# EAGLE design air_quality_monitor (EAGLE 7.7.0)
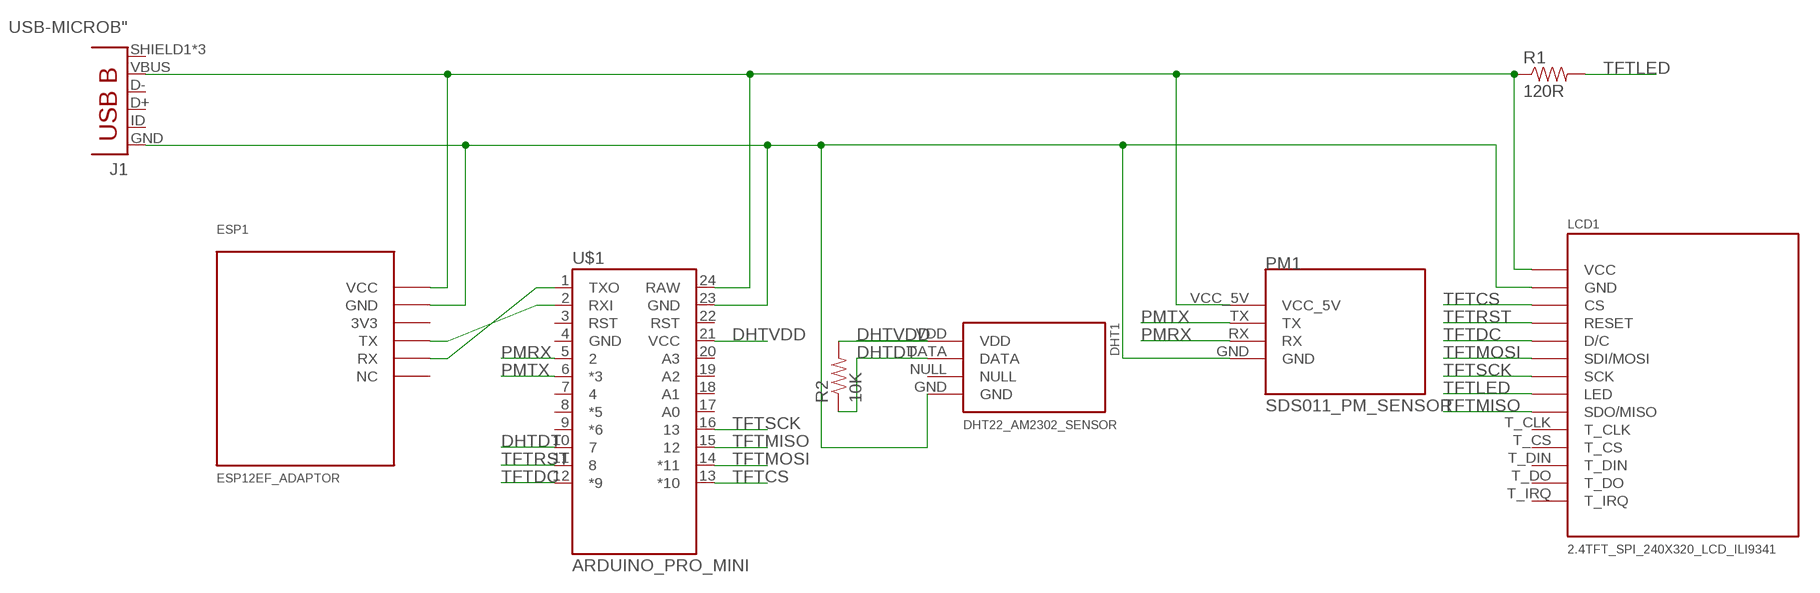
[diagram p0: schematic, sheet 1]

## Parts
DHT1  DHT22_AM2302_SENSOR  [DHT22_AM2302_SENSOR]
ESP1  ESP12EF_ADAPTOR  [ESP12EF_ADAPTOR]
J1  USB-MICROB"  [USB-B-MICRO-SMD_V03]
LCD1  2.4TFT_SPI_240X320_LCD_ILI9341  [2.4TFT_SPI_240X320_LCD_ILI9341]
PM1  SDS011_PM_SENSOR  [SDS011_PM_SENSOR]
R1  120R  10KOHM-1/10W-1%(0603)0603  [0603-RES]
R2  10K  10KOHM-1/10W-1%(0603)0603  [0603-RES]
U$1  ARDUINO_PRO_MINI  [ARDUINO_PRO_MINI]

## Nets
DHTDT: DHT1.DATA R2.1 U$1.10
DHTVDD: DHT1.VDD R2.2 U$1.21(VCC)
N$1: DHT1.GND ESP1.GND J1.GND LCD1.GND PM1.GND U$1.23(GND)
N$2: ESP1.VCC J1.VBUS LCD1.VCC PM1.VCC_5V R1.1 U$1.24(RAW)
N$8: ESP1.TX U$1.2(RXI)
N$9: ESP1.RX U$1.1(TXO)
PMRX: PM1.RX U$1.5
PMTX: PM1.TX U$1.6(*3)
TFTCS: LCD1.CS U$1.13(*10)
TFTDC: LCD1.D/C U$1.12(*9)
TFTLED: LCD1.LED R1.2
TFTMISO: LCD1.SDO/MISO U$1.15
TFTMOSI: LCD1.SDI/MOSI U$1.14(*11)
TFTRST: LCD1.RESET U$1.11
TFTSCK: LCD1.SCK U$1.16
Unconnected: DHT1.NULL ESP1.3V3 ESP1.NC J1.D+ J1.D- J1.ID(USBID) J1.SHIELD1(SHIELD) J1.SHIELD2(SHIELD) J1.SHIELD3(SHIELD) LCD1.T_CLK LCD1.T_CS LCD1.T_DIN LCD1.T_DO LCD1.T_IRQ U$1.3(RST) U$1.4(GND) U$1.7 U$1.8(*5) U$1.9(*6) U$1.17(A0) U$1.18(A1) U$1.19(A2) U$1.20(A3) U$1.22(RST)

## Library data of the parts
DHT1 = air_quality_monitor:DHT22_AM2302_SENSOR
ESP1 = air_quality_monitor:ESP12EF_ADAPTOR: ESP-12E/F Adaptor designed by IFFPC.
J1 = air_quality_monitor:USB-MICROB: RED_PASTE version has 70% paste area under D+ D- USBID pins for applications where those pins aren't required, to reduce the likelihood of bridges.; PROD_ID: CONN-11752
LCD1 = air_quality_monitor:2.4TFT_SPI_240X320_LCD_ILI9341: 2.2 inch 240x320 TFT LCD Module with SPI Interface.
PM1 = air_quality_monitor:SDS011_PM_SENSOR: SDS011 Laser PM2.5 Sensor Nova Fitness Co.,Ltd
R1 = air_quality_monitor:10KOHM-1/10W-1%(0603): RES-00824; PROD_ID: RES-00824; VALUE: 10K
R2 = air_quality_monitor:10KOHM-1/10W-1%(0603): RES-00824; PROD_ID: RES-00824
U$1 = air_quality_monitor:ARDUINO_PRO_MINI

## Board
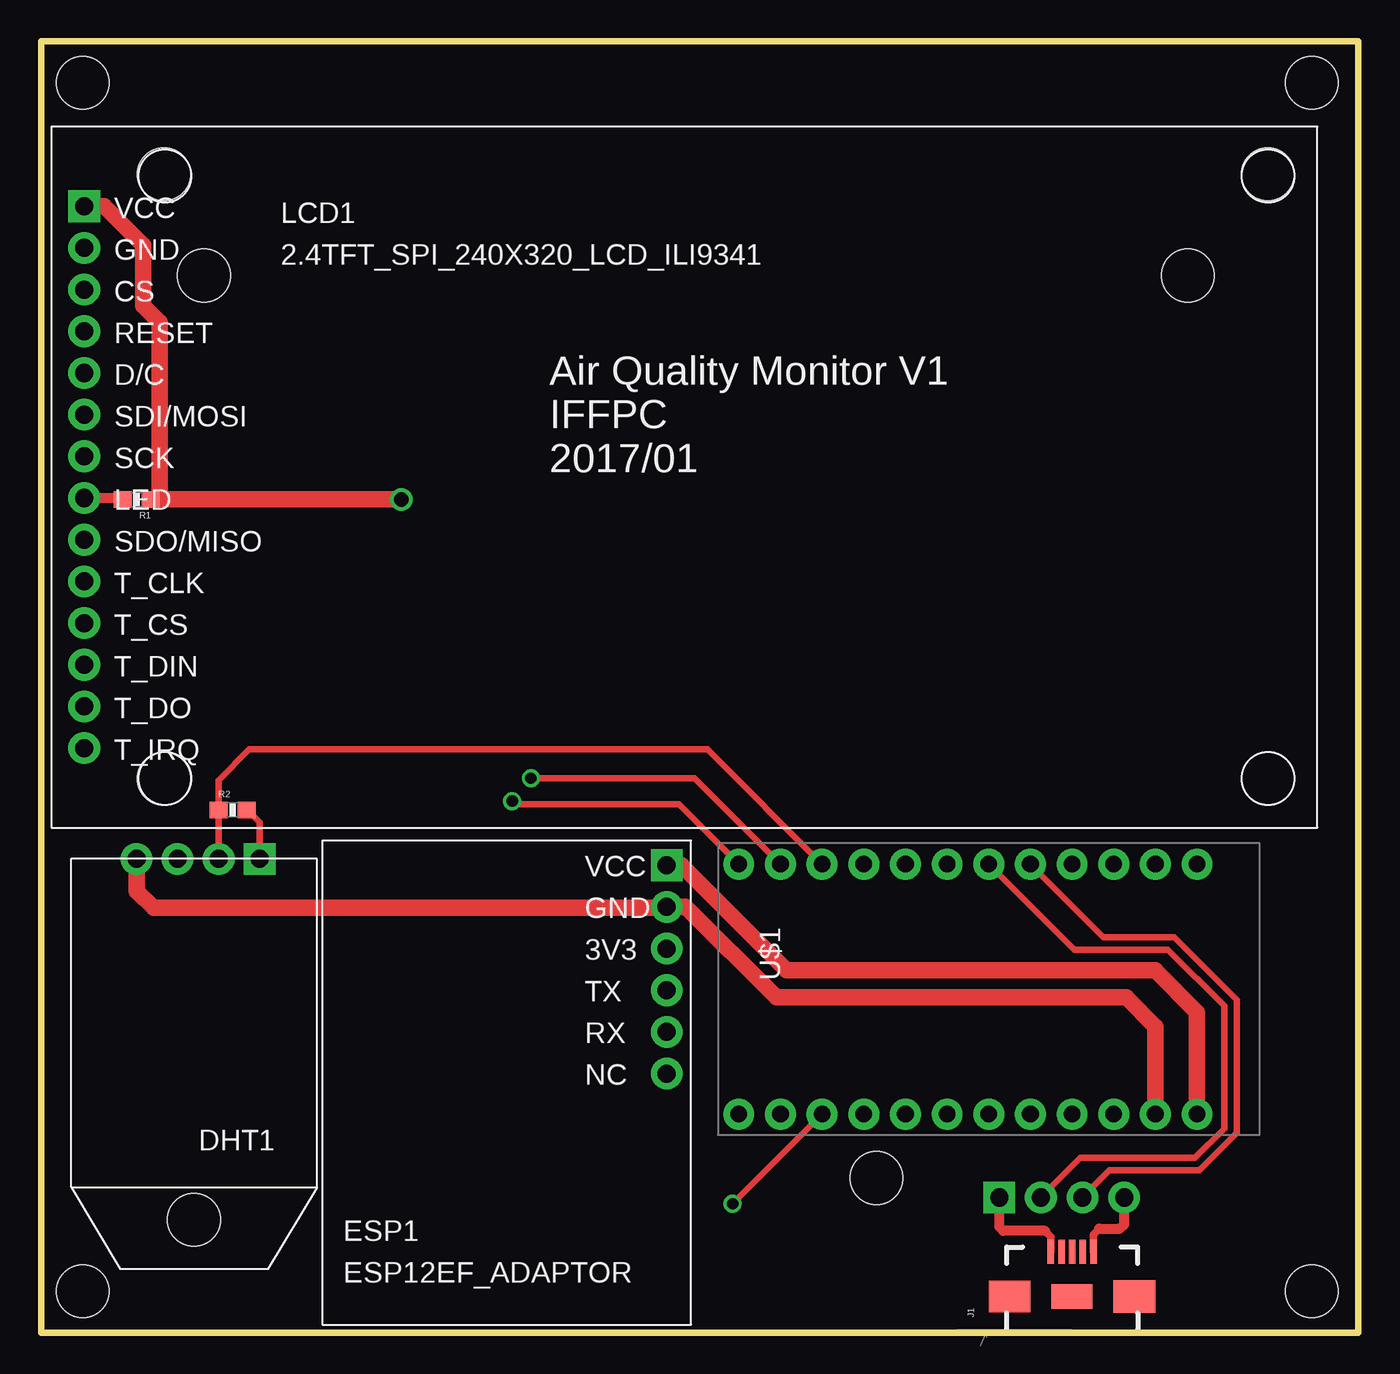
[diagram p1: board, top side]
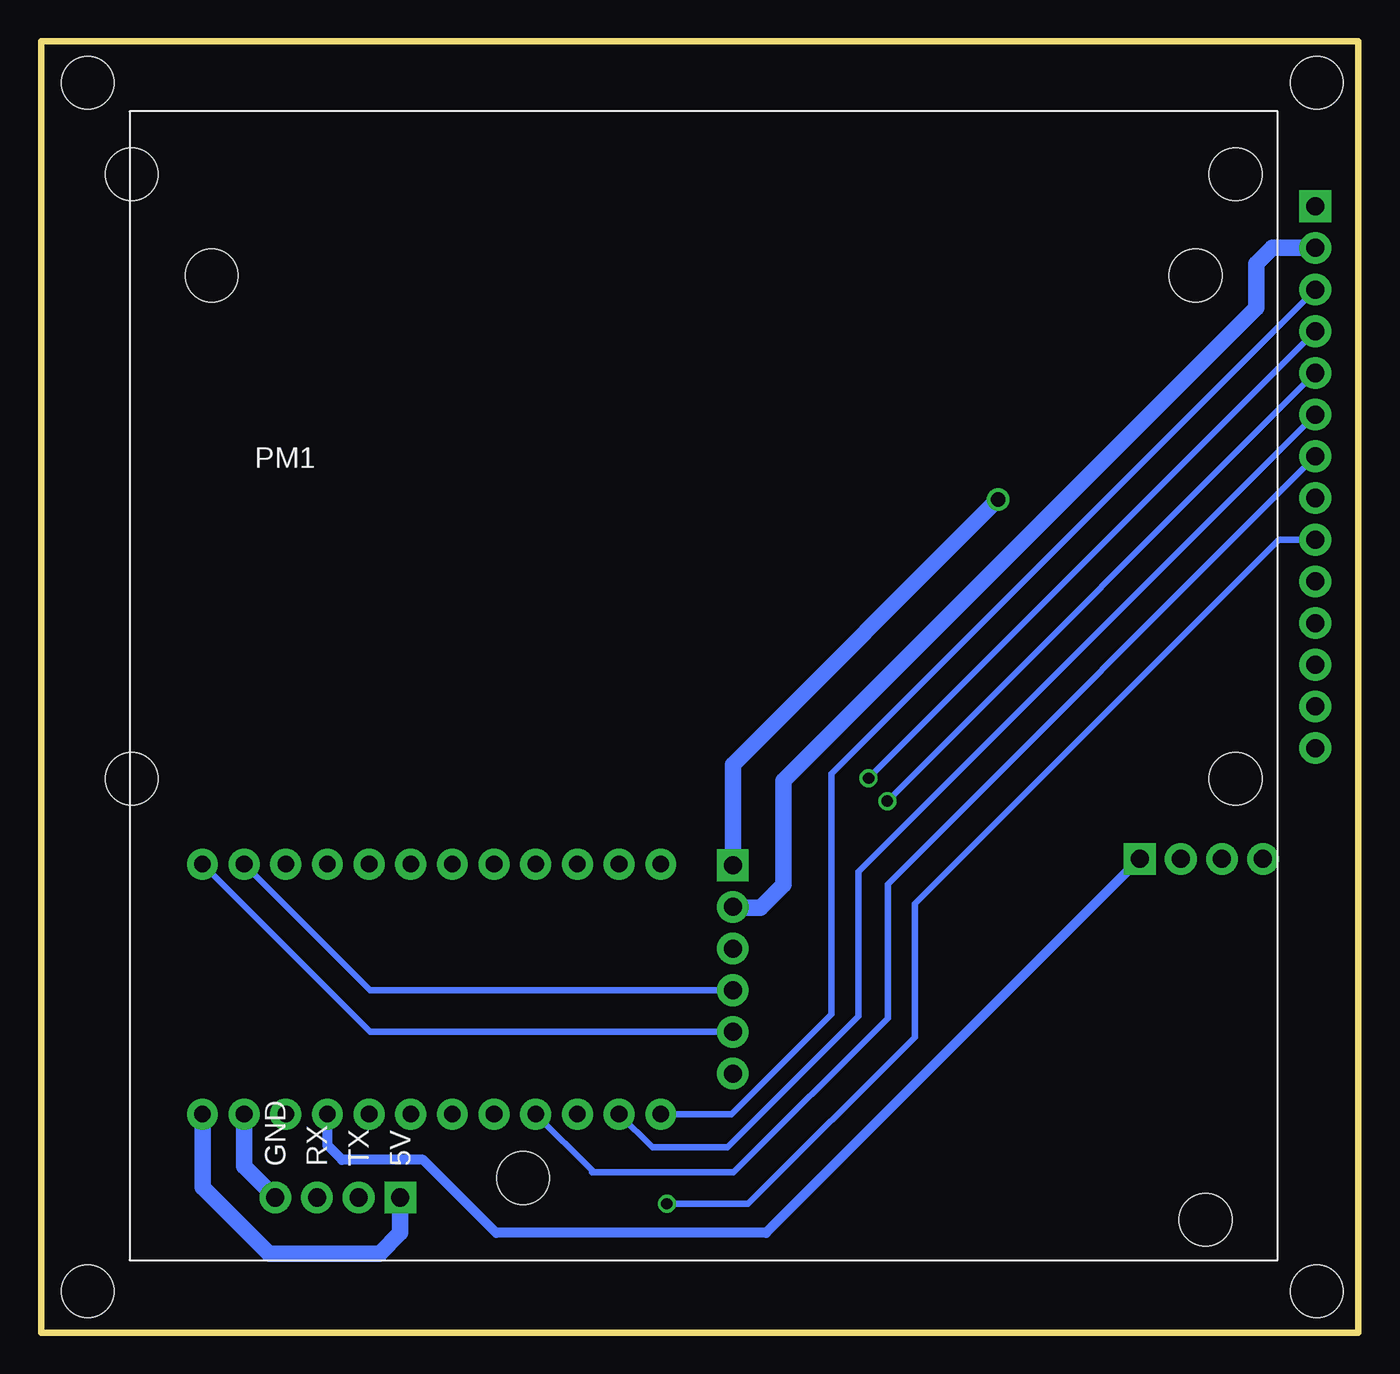
[diagram p2: board, bottom side, seen from below]

Size 80.33 x 78.74 mm. Coordinates in mm from the lower left corner, seen from the top.
Outline: 0,0 0,78.74 80.33,78.74 80.33,0 0,0
Copper layers (1*16): Top 0.035mm / dielectric 1.5mm / Bottom 0.035mm
Design rules "default": minimum track width 10mil, minimum drill 24mil, track to track 8mil, track to pad 8mil, pad to pad 8mil, via to via 8mil, smd to smd 8mil, copper to edge 40mil, drill to drill 8mil, minimum pad ring 10mil, minimum via ring 8mil, stop-mask expansion 4mil, vias tented up to drill 0mil, thermal gap 10mil
Holes 3.2 mm at 2.54,2.54 2.54,76.2 77.47,2.54 77.47,76.2 7.49,70.61 74.8,70.61 74.8,33.78 7.49,33.78

### Footprints (pad centres in the part's own frame; a part is rotated, then mirrored left to right if it is on the bottom)
DHT22_AM2302_SENSOR = drill 1.1 pad 1.93: DATA 6,0; GND 11,0; NULL 8.5,0 | drill 1.1 pad 1.93 square: VDD 3.5,0 | hole 3.2: 7.5,22
ESP12EF_ADAPTOR = drill 1.1 pad 1.93: 3V3 21,22.92; GND 21,25.46; NC 21,15.3; RX 21,17.84; TX 21,20.38 | drill 1.1 pad 1.93 square: VCC 21,28
USB-B-MICRO-SMD_V03 = smd 1.45 x 0.4: D+ 2.725,0; D- 2.725,0.65; GND 2.725,-1.3; ID 2.725,-0.65; VBUS 2.725,1.3 | smd 1.93 x 2.54: SHIELD1 0,3.8 | smd 1.956 x 2.54: SHIELD2 0,-3.8 | smd 1.5 x 2.5: SHIELD3 0,0
2.4TFT_SPI_240X320_LCD_ILI9341 = drill 1.1 pad 1.93: CS 2,32.79; D/C 2,27.71; GND 2,35.33; LED 2,20.09; RESET 2,30.25; SCK 2,22.63; SDI/MOSI 2,25.17; SDO/MISO 2,17.55; T_CLK 2,15.01; T_CS 2,12.47; T_DIN 2,9.93; T_DO 2,7.39; T_IRQ 2,4.85 | drill 1.1 pad 1.93 square: VCC 2,37.87
SDS011_PM_SENSOR = drill 1.1 pad 1.93: GND 8.89,3.81; RX 11.43,3.81; TX 13.97,3.81 | drill 1.1 pad 1.93 square: VCC_5V 16.51,3.81 | hole 3.2: 24,5; 5,60; 65,60
0603-RES = smd 1.1 x 1: 1 -0.85,0; 2 0.85,0
ARDUINO_PRO_MINI = drill 1.016 pad 1.88: 1 -7.62,12.7; 2 -7.62,10.16; 3 -7.62,7.62; 4 -7.62,5.08; 5 -7.62,2.54; 6 -7.62,0; 7 -7.62,-2.54; 8 -7.62,-5.08; 9 -7.62,-7.62; 10 -7.62,-10.16; 11 -7.62,-12.7; 12 -7.62,-15.24; 13 7.62,-15.24; 14 7.62,-12.7; 15 7.62,-10.16; 16 7.62,-7.62; 17 7.62,-5.08; 18 7.62,-2.54; 19 7.62,0; 20 7.62,2.54; 21 7.62,5.08; 22 7.62,7.62; 23 7.62,10.16; 24 7.62,12.7

### Placement (x,y rotation side)
DHT1  16.83,28.89 180 top
ESP1  17.14,0.51 0 top
J1  62.87,2.22 90 top
LCD1  0.64,30.8 0 top
PM1  74.93,4.45 0 bottom
R1  5.84,50.8 180 top
R2  11.68,31.88 0 top
U$1  57.78,20.95 270 top

### Tracks (layer width: path | path; a pad name or v marks a point on that pad's centre or on a via)
DHTDT
  Top 0.406: U$1.10 40.64,35.56 12.7,35.56 10.83,33.69 R2.1 DHT1.DATA
DHTVDD
  Top 0.406: R2.2 12.57,31.88 13.34,31.11 DHT1.VDD
  Bottom 0.61: DHT1.VDD 36.12,6.1 52.58,6.1 57.02,10.54 61.98,10.54 62.87,11.43 U$1.21
N$1
  Top 0.254: 38.63,26.29 ESP1.GND | DHT1.GND 5.94,29.03 5.84,28.88
  Top 0.457: J1.GND 64.17,6 64.52,6.35
  Top 0.61: 64.52,6.35 65.79,6.35 66.04,6.6 PM1.GND
  Top 1.016: 5.84,28.88 5.84,26.92 6.86,25.91 38.09,25.91 ESP1.GND 39.31,25.97 44.83,20.45 66.17,20.45 67.94,18.67 U$1.23
  Bottom 0.254: 38.63,26.29 ESP1.GND
  Bottom 1.016: LCD1.GND 5.25,66.13 6.22,65.15 6.22,62.48 35.05,33.66 35.05,27.3 36.45,25.91 38.09,25.91 ESP1.GND | U$1.23 67.94,10.16 PM1.GND
N$2  (via drill 0.9)
  Top 0.457: J1.VBUS 61.56,5.87 61.21,6.22
  Top 0.61: 61.21,6.22 58.67,6.22 58.42,6.48 PM1.VCC_5V
  Top 1.016: ESP1.VCC 39.06,28.51 45.47,22.1 67.94,22.1 70.48,19.56 U$1.24 | 7.24,50.8 R1.1 6.71,50.8 | 7.24,50.8 v21.97,50.8 | LCD1.VCC 3.85,68.67 6.22,66.29 6.22,62.61 7.24,61.59 7.24,50.8
  Bottom 1.016: U$1.24 70.48,8.89 66.42,4.83 59.69,4.83 58.42,6.1 PM1.VCC_5V | v21.97,50.8 38.15,34.63 ESP1.VCC
N$8
  Bottom 0.406: ESP1.TX 60.26,20.89 U$1.2
N$9
  Bottom 0.406: U$1.1 60.26,18.35 ESP1.RX
PMRX
  Top 0.406: PM1.RX 65.15,9.91 70.61,9.91 72.9,12.19 72.9,20.32 69.09,24.13 64.77,24.13 U$1.5
PMTX
  Top 0.406: PM1.TX 63.37,10.67 70.36,10.67 72.14,12.45 72.14,19.94 68.71,23.37 62.99,23.37 U$1.6
TFTCS
  Bottom 0.406: LCD1.CS 32.13,34.09 32.13,19.43 38.23,13.34 U$1.13
TFTDC  (via drill 0.7)
  Top 0.406: U$1.12 38.9,32.22 28.92,32.22 v28.73,32.41
  Bottom 0.406: LCD1.D/C v28.73,32.41
TFTLED
  Top 0.61: R1.2 4.9,50.89 LCD1.LED
TFTMISO  (via drill 0.7)
  Top 0.406: U$1.15 v42.16,7.87
  Bottom 0.406: LCD1.SDO/MISO 4.87,48.35 27.05,26.16 27.05,18.03 37.21,7.87 v42.16,7.87
TFTMOSI
  Bottom 0.406: LCD1.SDI/MOSI 30.48,28.12 30.48,19.3 38.48,11.3 43.05,11.3 U$1.14
TFTRST  (via drill 0.7)
  Top 0.406: U$1.11 39.85,33.81 v29.88,33.81
  Bottom 0.406: LCD1.RESET v29.88,33.81
TFTSCK
  Bottom 0.406: LCD1.SCK 28.7,27.36 28.7,19.18 38.1,9.78 46.74,9.78 46.74,9.91 U$1.16

### Text on the board
tPlace: Air Quality Monitor V1 / IFFPC / 2017/01